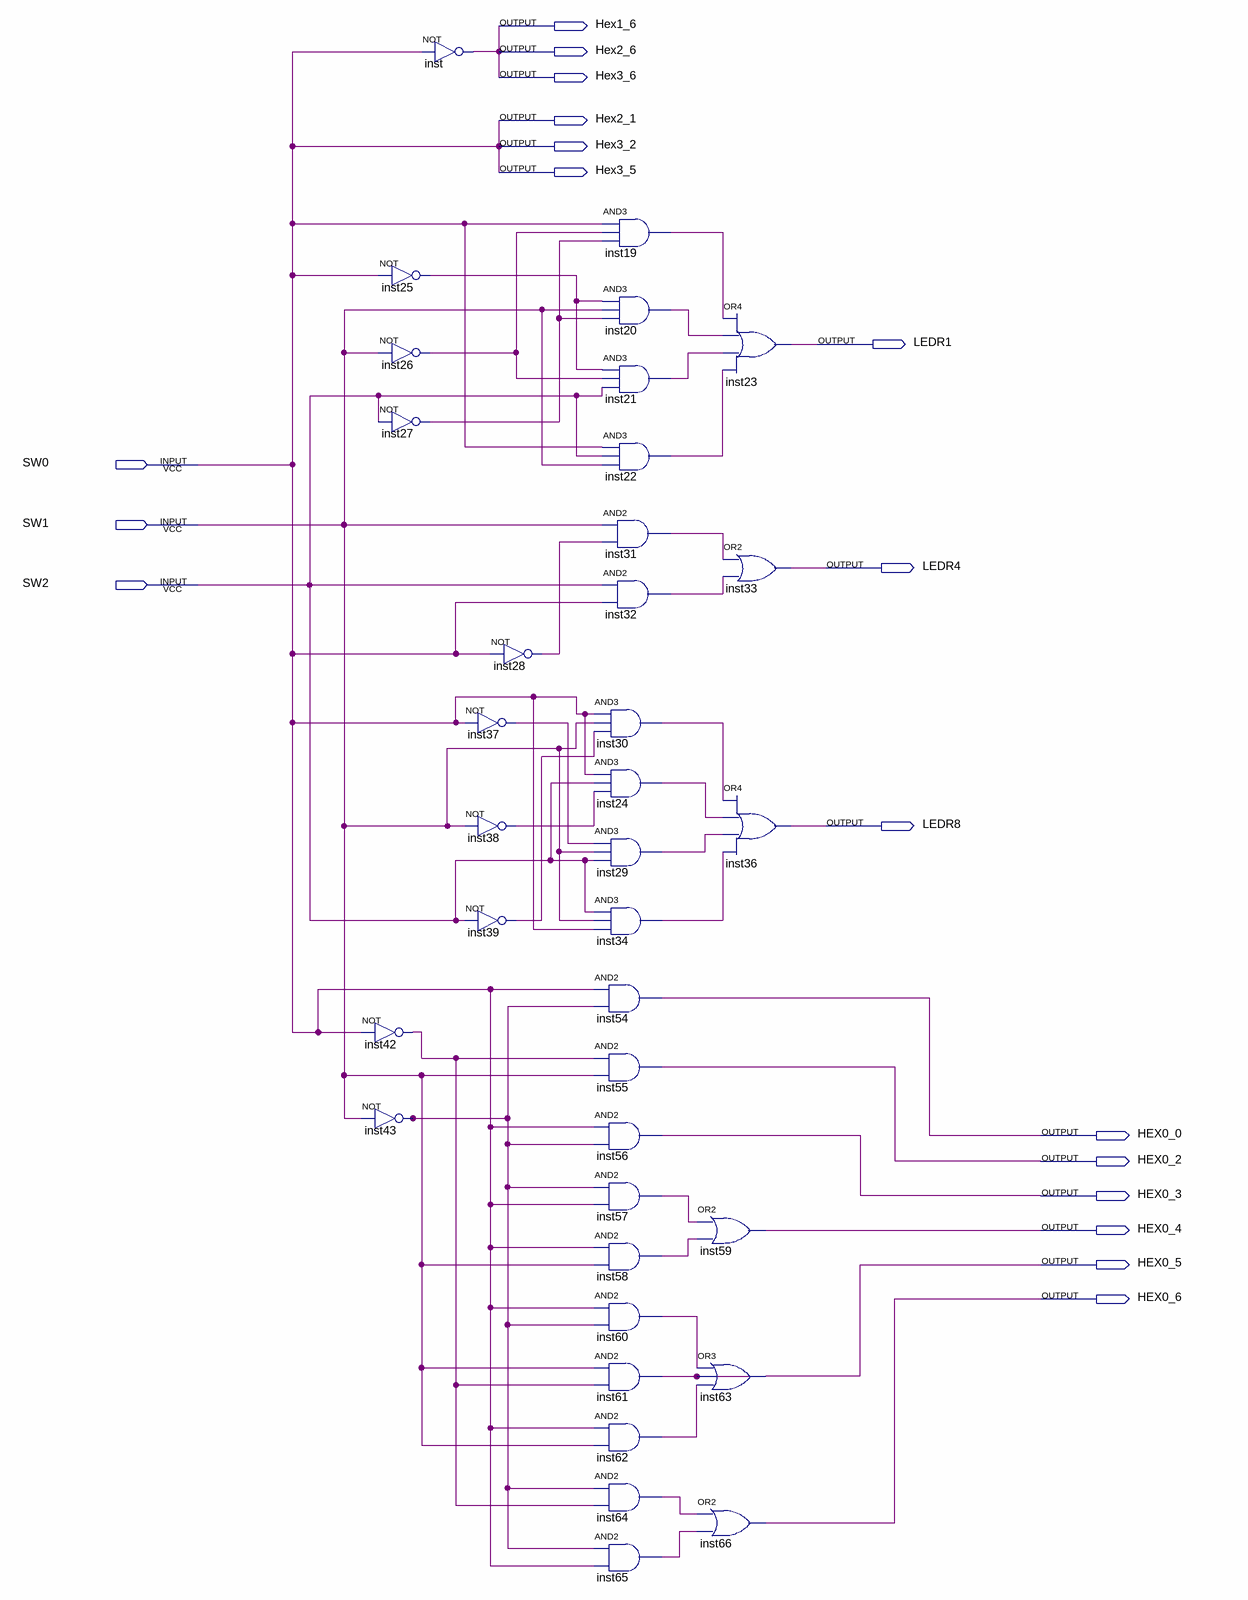
[diagram p0: schematic sheet]
// Quartus schematic L1C268.bdf as structural Verilog: 36 symbols, 18 pins
module L1C268 (
  input  SW0,
  input  SW1,
  input  SW2,
  output Hex1_6,
  output Hex2_6,
  output Hex3_6,
  output Hex2_1,
  output Hex3_2,
  output Hex3_5,
  output LEDR1,
  output LEDR4,
  output LEDR8,
  output HEX0_0,
  output HEX0_2,
  output HEX0_3,
  output HEX0_4,
  output HEX0_5,
  output HEX0_6
);

  wire inst19_out, inst20_out, inst21_out, inst22_out, inst24_out, inst25_out, inst26_out, inst27_out,
       inst28_out, inst29_out, inst30_out, inst31_out, inst32_out, inst34_out, inst37_out, inst38_out,
       inst39_out, inst42_out, inst43_out, inst57_out, inst58_out, inst60_out, inst61_out, inst62_out,
       inst64_out, inst65_out;

  not inst42 (inst42_out, SW0);
  not inst43 (inst43_out, SW1);
  not inst (Hex1_6, SW0);
  not inst25 (inst25_out, SW0);
  not inst26 (inst26_out, SW1);
  not inst27 (inst27_out, SW2);
  not inst28 (inst28_out, SW0);
  not inst37 (inst37_out, SW0);
  not inst38 (inst38_out, SW1);
  not inst39 (inst39_out, SW2);
  and inst19 (inst19_out, SW0, inst26_out, inst27_out);
  and inst20 (inst20_out, inst25_out, SW1, inst27_out);
  and inst21 (inst21_out, inst25_out, inst26_out, SW2);
  and inst22 (inst22_out, SW0, SW2, SW1);
  and inst31 (inst31_out, SW1, inst28_out);
  and inst32 (inst32_out, SW2, SW0);
  and inst30 (inst30_out, SW0, SW1, inst39_out);
  and inst24 (inst24_out, SW0, SW2, inst38_out);
  and inst29 (inst29_out, inst37_out, SW1, SW2);
  and inst34 (inst34_out, SW2, SW1, SW0);
  and inst54 (HEX0_0, SW0, inst43_out);
  and inst55 (HEX0_2, inst42_out, SW1);
  and inst56 (HEX0_3, SW0, inst43_out);
  and inst57 (inst57_out, inst43_out, SW0);
  and inst58 (inst58_out, SW0, SW1);
  and inst60 (inst60_out, SW0, inst43_out);
  and inst61 (inst61_out, SW1, inst42_out);
  and inst62 (inst62_out, SW0, SW1);
  and inst64 (inst64_out, inst43_out, inst42_out);
  and inst65 (inst65_out, inst43_out, SW0);
  or inst59 (HEX0_4, inst57_out, inst58_out);
  or inst63 (HEX0_5, inst60_out, inst61_out, inst62_out);
  or inst66 (HEX0_6, inst64_out, inst65_out);
  or inst23 (LEDR1, inst19_out, inst20_out, inst21_out, inst22_out);
  or inst33 (LEDR4, inst31_out, inst32_out);
  or inst36 (LEDR8, inst30_out, inst24_out, inst29_out, inst34_out);

  assign Hex2_1 = SW0;
  assign Hex2_6 = Hex1_6;
  assign Hex3_2 = SW0;
  assign Hex3_5 = SW0;
  assign Hex3_6 = Hex1_6;
endmodule
